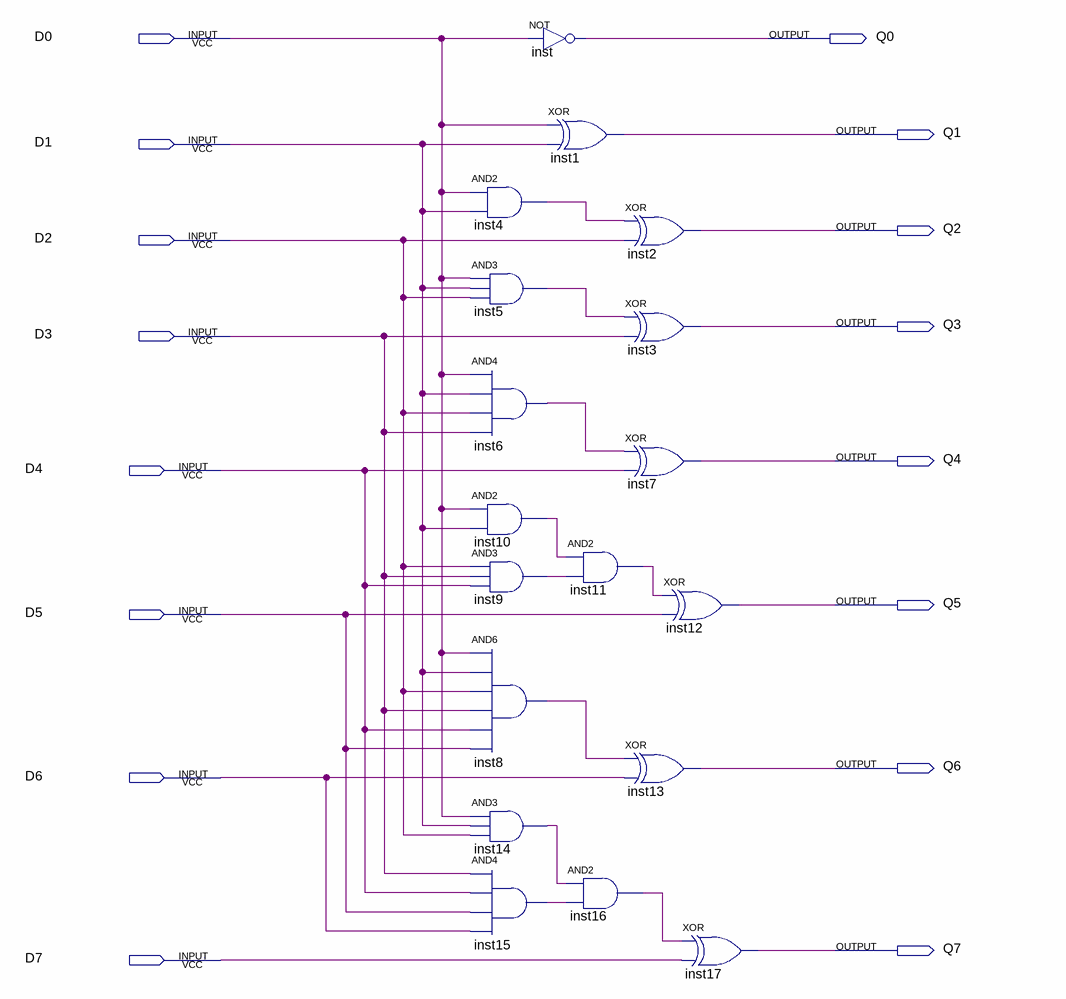
[diagram p0: schematic sheet]
// Quartus schematic Increment_8.bdf as structural Verilog: 18 symbols, 16 pins
module Increment_8 (
  input  D0,
  input  D1,
  input  D2,
  input  D3,
  input  D4,
  input  D5,
  input  D6,
  input  D7,
  output Q0,
  output Q1,
  output Q2,
  output Q3,
  output Q4,
  output Q5,
  output Q6,
  output Q7
);

  wire inst4_out, inst5_out, inst6_out, inst8_out, inst9_out, inst10_out, inst11_out, inst14_out, inst15_out,
       inst16_out;

  and inst4 (inst4_out, D0, D1);
  and inst5 (inst5_out, D0, D1, D2);
  and inst6 (inst6_out, D0, D1, D2, D3);
  and inst10 (inst10_out, D0, D1);
  and inst9 (inst9_out, D2, D3, D4);
  and inst8 (inst8_out, D0, D1, D2, D3, D4, D5);
  and inst14 (inst14_out, D0, D1, D2);
  and inst15 (inst15_out, D3, D4, D5, D6);
  not inst (Q0, D0);
  xor inst1 (Q1, D0, D1);
  and inst11 (inst11_out, inst10_out, inst9_out);
  and inst16 (inst16_out, inst14_out, inst15_out);
  xor inst2 (Q2, inst4_out, D2);
  xor inst3 (Q3, inst5_out, D3);
  xor inst7 (Q4, inst6_out, D4);
  xor inst12 (Q5, inst11_out, D5);
  xor inst13 (Q6, inst8_out, D6);
  xor inst17 (Q7, inst16_out, D7);
endmodule
